# EAGLE schematic buck module 5v (EAGLE 9.5.2)
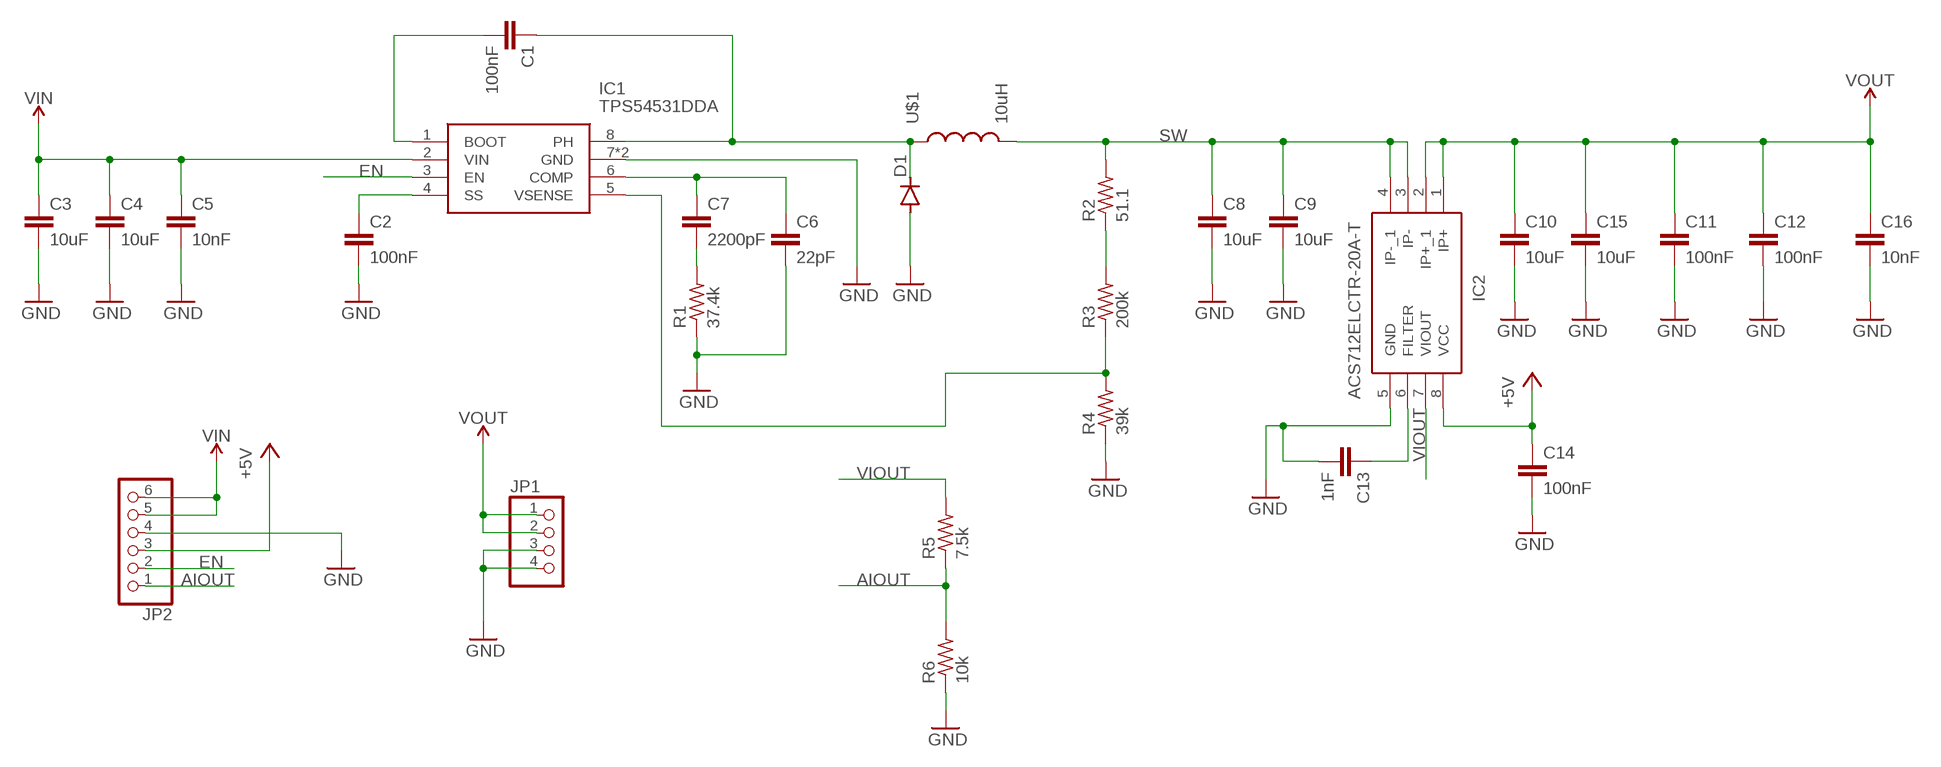
[diagram p0: schematic, sheet 1]

## Parts
C1  100nF  C-EUC0603  [C0603]
C2  100nF  C-EUC0603  [C0603]
C3  10uF  C-EUC1206  [C1206]
C4  10uF  C-EUC1206  [C1206]
C5  10nF  C-EUC0603  [C0603]
C6  22pF  C-EUC0603  [C0603]
C7  2200pF  C-EUC0603  [C0603]
C8  10uF  C-EUC1206  [C1206]
C9  10uF  C-EUC1206  [C1206]
C10  10uF  C-EUC1206  [C1206]
C11  100nF  C-EUC0603  [C0603]
C12  100nF  C-EUC0603  [C0603]
C13  1nF  C-EUC0603  [C0603]
C14  100nF  C-EUC0603  [C0603]
C15  10uF  C-EUC1206  [C1206]
C16  10nF  C-EUC0603  [C0603]
D1  DIODE-DO214AA  [DO214AA]
IC1  TPS54531DDA  [SOIC127P600X170-9N]
IC2  ACS712ELCTR-20A-T  [SOIC127P600X175-8N]
JP1  PINHD-1X4  [1X04]
JP2  PINHD-1X6  [1X06]
R1  37.4k  R-US_R0603  [R0603]
R2  51.1  R-US_R0603  [R0603]
R3  200k  R-US_R0603  [R0603]
R4  39k  R-US_R0603  [R0603]
R5  7.5k  R-US_R0603  [R0603]
R6  10k  R-US_R0603  [R0603]
U$1  10uH  22UH-1040-5A  [22UH-1040-5A]

## Nets
+5V: C14.1 IC2.8(VCC) JP2.3
AIOUT: JP2.1 R5.1 R6.2
EN: IC1.3(EN) JP2.2
GND: C2.2 C3.2 C4.2 C5.2 C6.2 C8.2 C9.2 C10.2 C11.2 C12.2 C13.2 C14.2 C15.2 C16.2 D1.A IC1.7(GND) IC1.9(GND) IC2.5(GND) JP1.3 JP1.4 JP2.4 R1.1 R4.1 R6.1
N$1: C1.2 IC1.1(BOOT)
N$2: C1.1 D1.C IC1.8(PH) U$1.P$1
N$3: C7.2 R1.2
N$4: C2.1 IC1.4(SS)
N$5: C6.1 C7.1 IC1.6(COMP)
N$7: C13.1 IC2.6(FILTER)
N$9: R2.1 R3.2
N$11: IC1.5(VSENSE) R3.1 R4.2
SW: C8.1 C9.1 IC2.3(IP-) IC2.4(IP-_1) R2.2 U$1.P$2
VIN: C3.1 C4.1 C5.1 IC1.2(VIN) JP2.5 JP2.6
VIOUT: IC2.7(VIOUT) R5.2
VOUT: C10.1 C11.1 C12.1 C15.1 C16.1 IC2.1(IP+) IC2.2(IP+_1) JP1.1 JP1.2

## Library data of the parts
C1-C16 = rcl:C-EU: CAPACITOR, European symbol; SPICEPREFIX: C
D1 = diode:DIODE-: DIODE
IC1 = LCSC:TPS54531DDA: 3.5V to 28V Input, 5A, 570kHz Step-Down Converter with Eco-mode Source: Datasheet <http://www.ti.com/lit/gpn/tps54531>; DESCRIPTION: 3.5V to 28V Input, 5A, 570kHz Step-Down Converter with Eco-mode; HEIGHT: 1.7mm; MANUFACTURER_NAME: Texas Instruments; MANUFACTURER_PART_NUMBER: TPS54531DDA; MOUSER_PART_NUMBER: 595-TPS54531DDA; MOUSER_PRICE-STOCK: https://www.mouser.com/Search/Refine.aspx?Keyword=595-TPS54531DDA
IC2 = LCSC:ACS712ELCTR-20A-T: ACS712ELCTR-20A-T, Hall Effect Sensor 5V 8-Pin SOIC, SOIC N Source: Datasheet <http://docs-emea.rs-online.com/webdocs/0d88/0900766b80d885f5.pdf>; ALLIED_NUMBER: R1076682; ALLIED_PRICE-STOCK: http://www.alliedelec.com/allegro-microsystems-acs712elctr-20a-t/R1076682/; DESCRIPTION: ACS712ELCTR-20A-T, Hall Effect Sensor 5V 8-Pin SOIC, SOIC N; HEIGHT: 1.75mm; MANUFACTURER_NAME: Allegro Microsystems; MANUFACTURER_PART_NUMBER: ACS712ELCTR-20A-T; RS_PART_NUMBER: 6807135P; RS_PRICE-STOCK: http://uk.rs-online.com/web/p/products/6807135P
JP1 = pinhead:PINHD-1X4: PIN HEADER
JP2 = pinhead:PINHD-1X6: PIN HEADER
R1-R6 = rcl:R-US_: RESISTOR, American symbol; SPICEPREFIX: R
U$1 = LCSC:22UH-1040-5A